# EasyEDA schematic SCH_Arduino Due (Open hardware)_2022-05-05.json

## Sheets
1 Arduino-DUE-V03 SCH
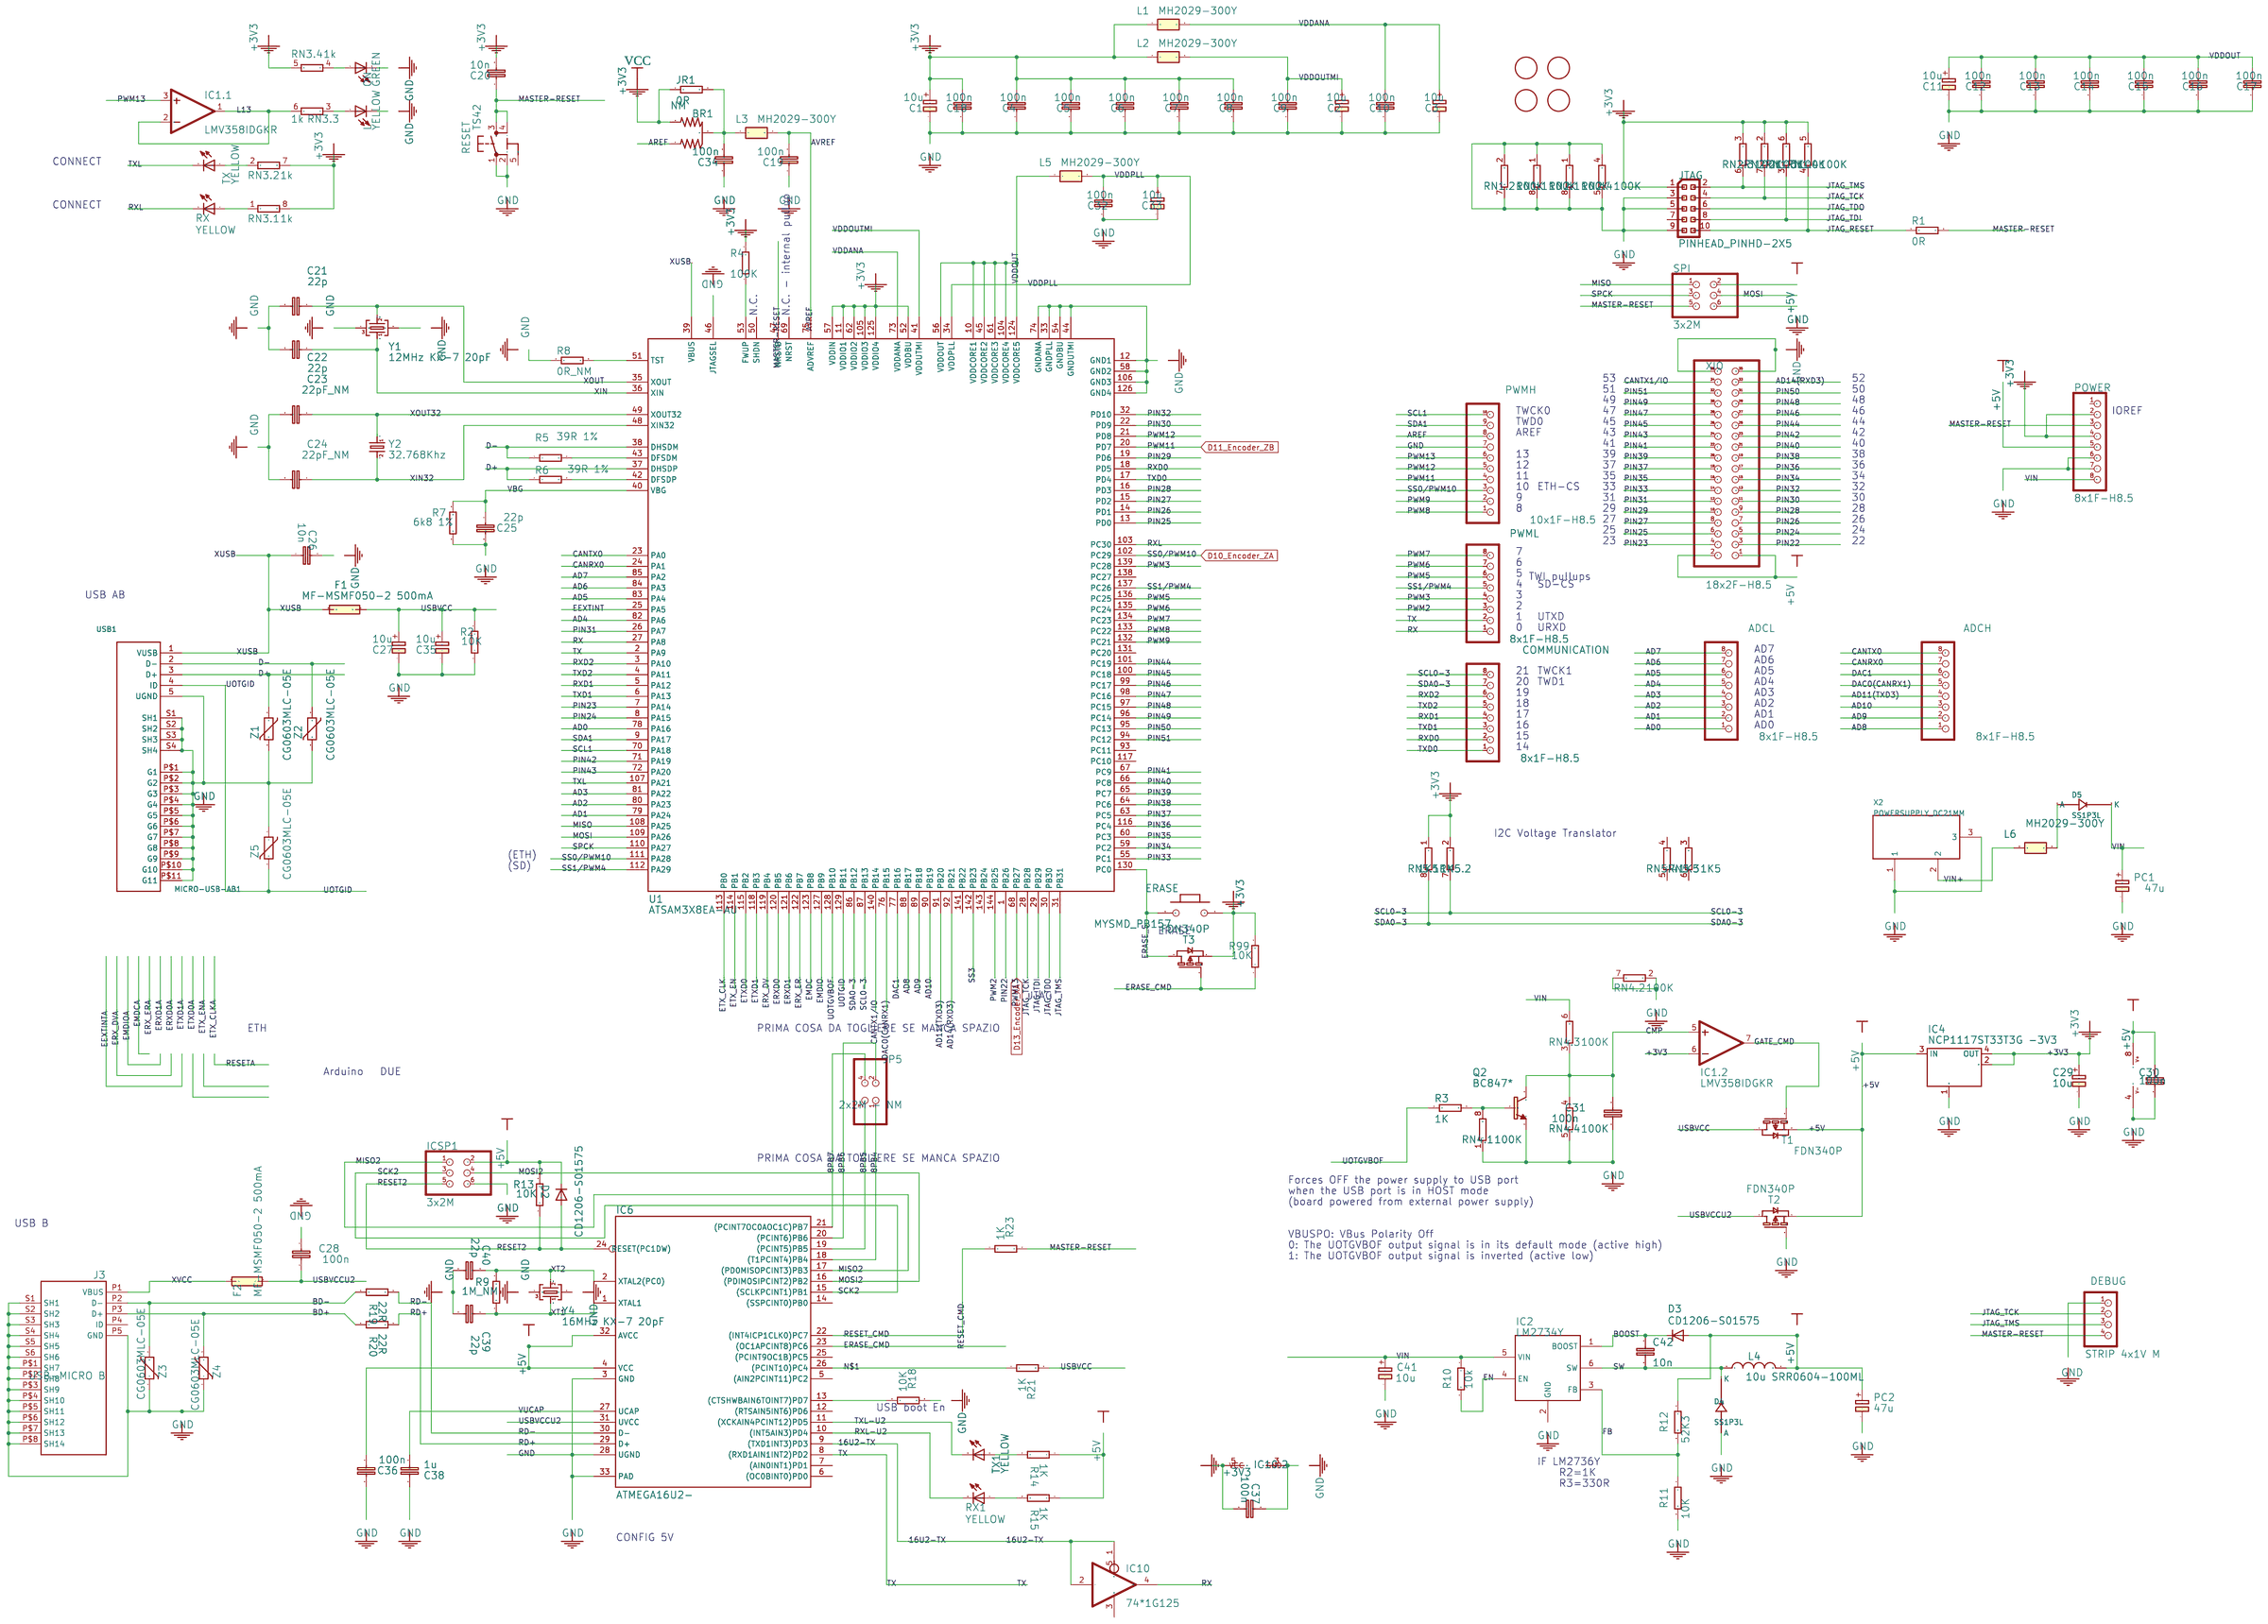
[diagram p0: Arduino-DUE-V03 SCH]
2 Pheripherie: TITLE: Periferie; REV: 1.0; Date: 2022-04-28; Sheet: 1/1; Drawn By: Radio “Radiome” Me; Company: Your Company
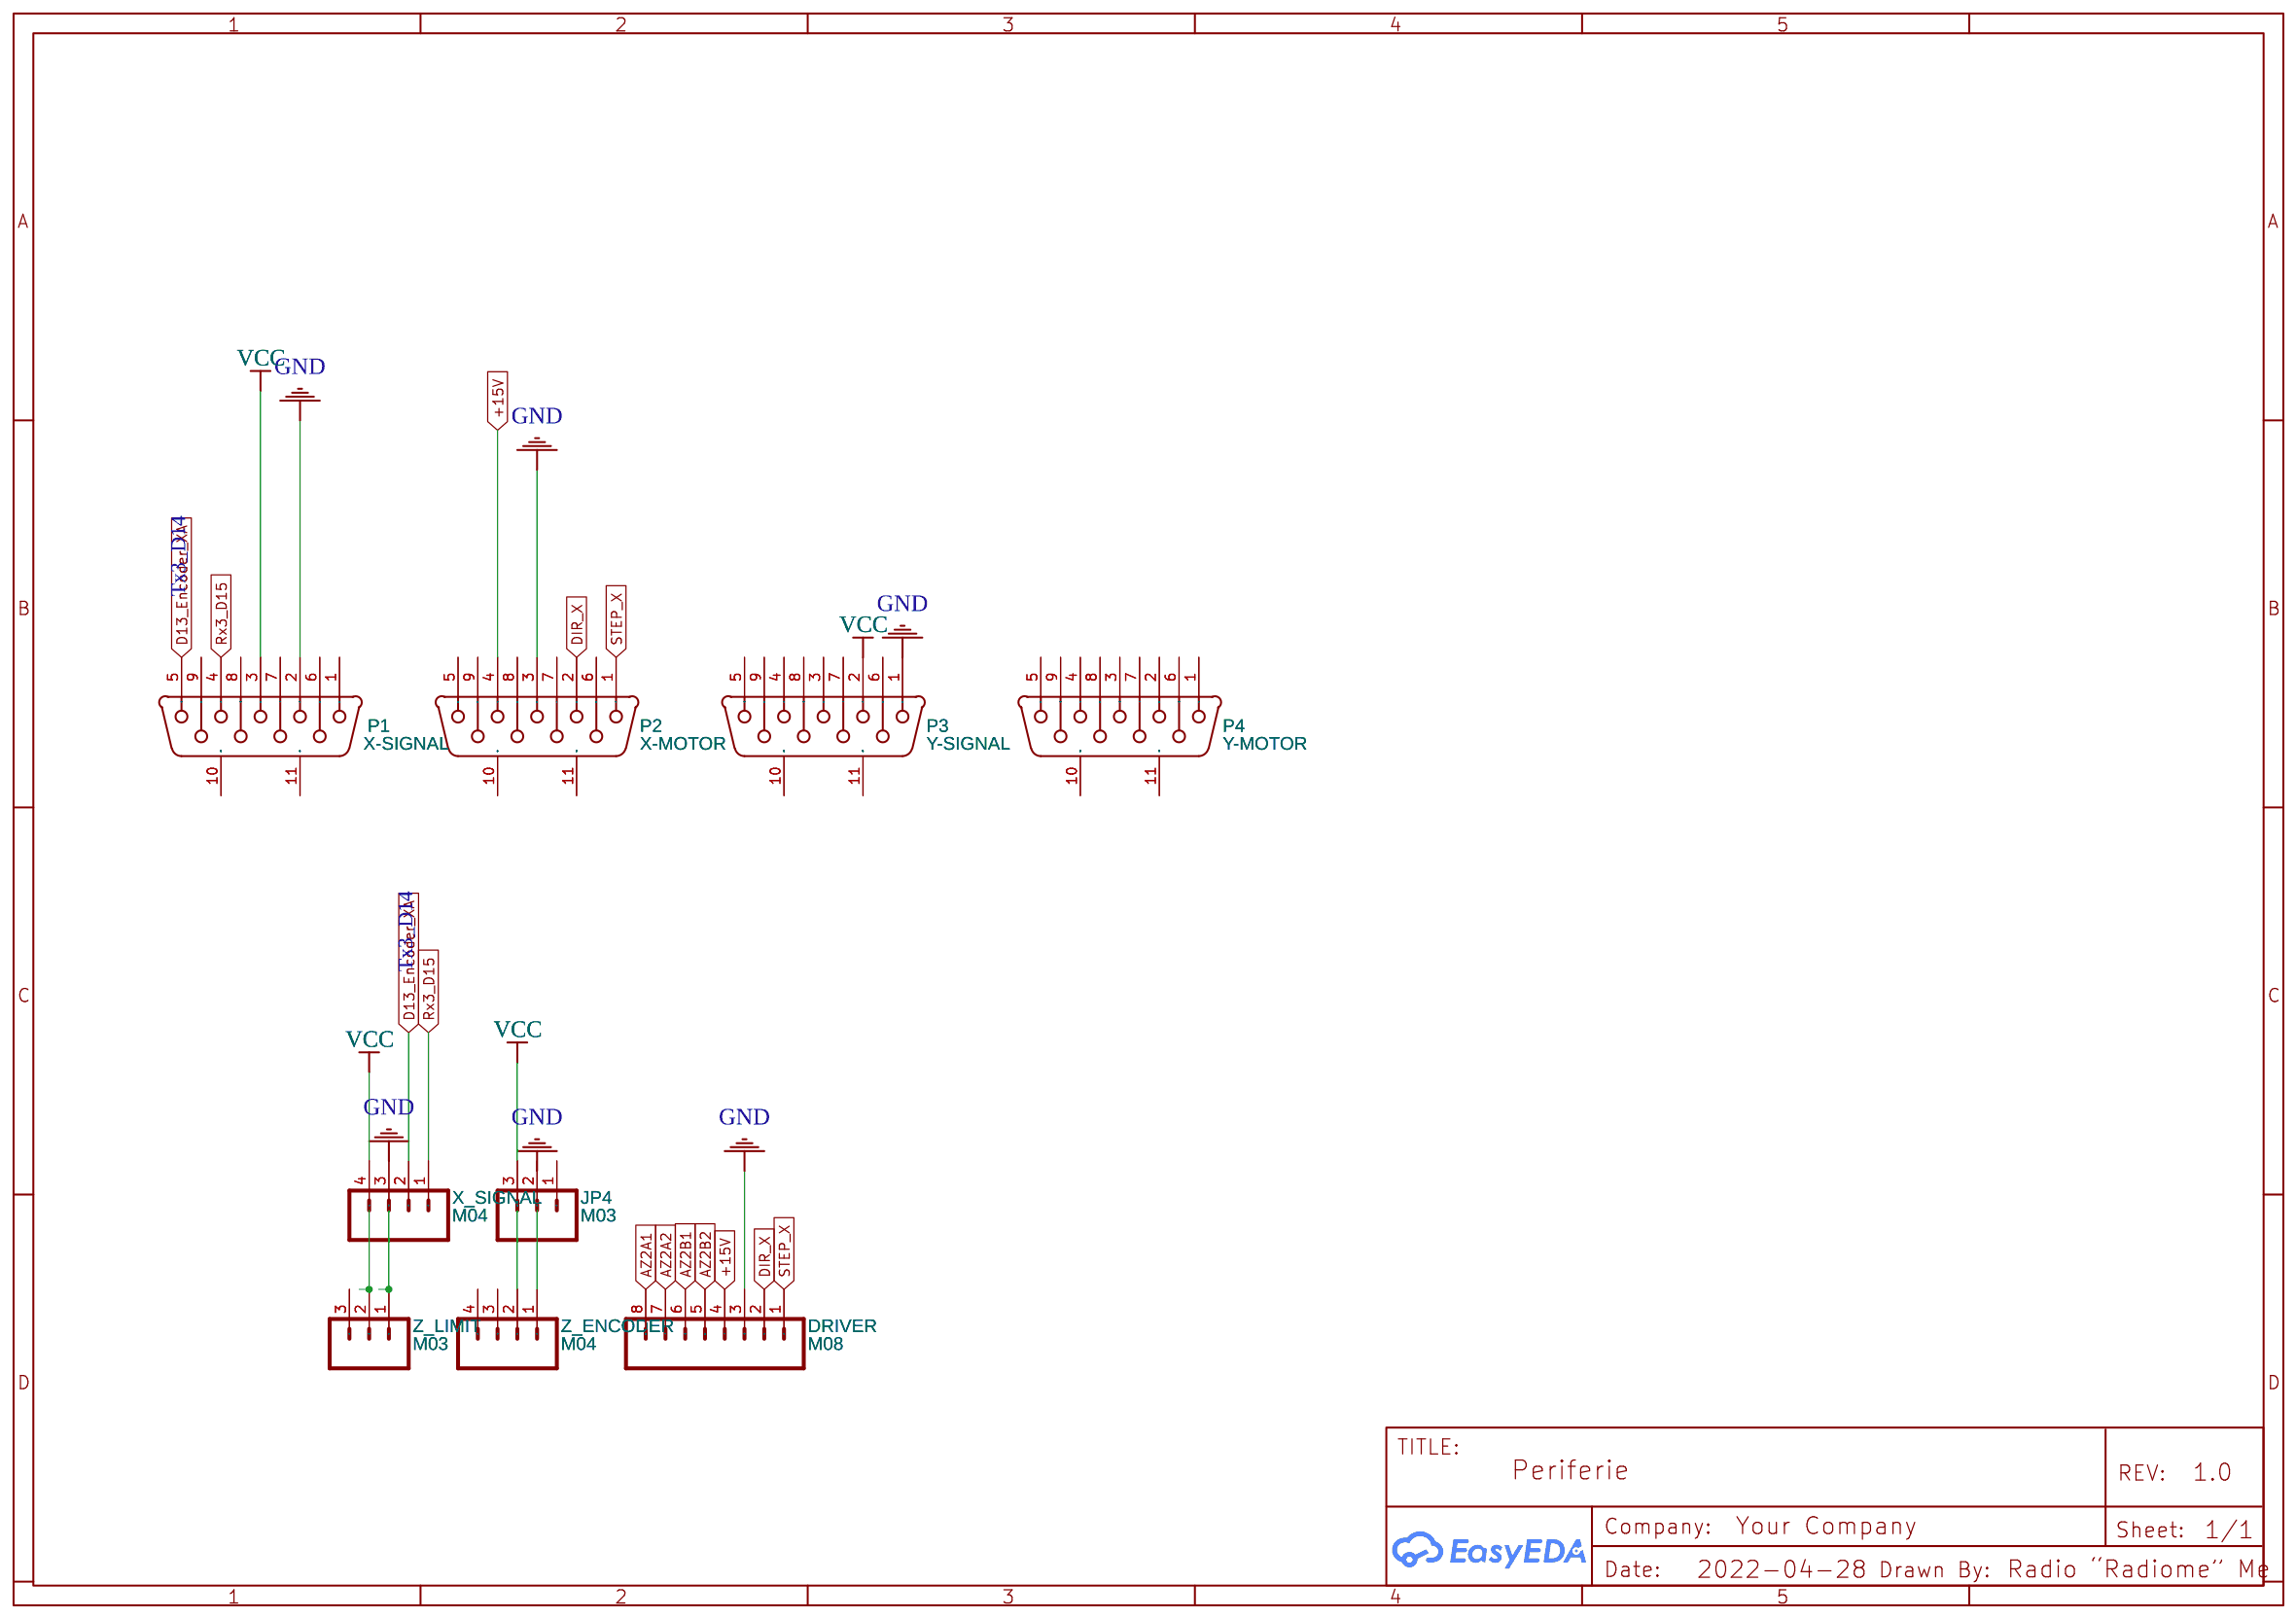
[diagram p1: Pheripherie]

## Parts
sheet Arduino-DUE-V03 SCH
ADCH  8x1F-H8.5  [1X08]
ADCL  8x1F-H8.5  [1X08]
BR1  NM  [J0402]
C1  10u  [SMC_B]
C2  10u  [SMC_B]
C3  10u  [SMC_B]
C4  100n  [C0402]
C5  100n  [C0402]
C6  100n  [C0402]
C7  100n  [C0402]
C8  100n  [C0402]
C9  100n  [C0402]
C10  100n  [C0402]
C11  10u  [SMC_B]
C12  100n  [C0402]
C13  100n  [C0402]
C14  100n  [C0402]
C15  100n  [C0402]
C16  100n  [C0402]
C17  100n  [C0402]
C18  100n  [C0402]
C19  100n  [C0402]
C20  10n  [C0402]
C21  22p  [C0402]
C22  22p  [C0402]
C23  22pF_NM  [C0402]
C24  22pF_NM  [C0402]
C25  22p  [C0402]
C26  10n  [C0402]
C27  10u  [SMC_B]
C28  100n  [C0402]
C29  10u  [SMC_B]
C30  100n  [C0402]
C31  100n  [C0402]
C32  100n  [C0402]
C33  10u  [SMC_B]
C34  100n  [C0402]
C35  10u  [SMC_B]
C36  100n  [C0402]
C37  100n  [C0402]
C38  1u  [C0402]
C39  22p  [C0402]
C40  22p  [C0402]
C41  10u  [SMC_B]
C42  10n  [C0603-ROUND]
COMMUNICATION  8x1F-H8.5  [1X08]
D2  CD1206-S01575  [MINIMELF]
D3  CD1206-S01575  [MINIMELF]
D4  SS1P3L  [DO220AAL]
D5  SS1P3L  [DO220AAL]
DEBUG  STRIP 4x1V M  [1X04]
ERASE  MYSMD_PB157  [SMD_157SW]
F1  MF-MSMF050-2 500mA  [L1812]
F2  MF-MSMF050-2 500mA  [L1812]
FID1  FIDUCIALMOUNT  [FIDUCIA-MOUNT]
FID2  FIDUCIALMOUNT  [FIDUCIA-MOUNT]
FID3  FIDUCIALMOUNT  [FIDUCIA-MOUNT]
FID4  FIDUCIALMOUNT  [FIDUCIA-MOUNT]
IC1  LMV358IDGKR  [MSOP08]  (sections 1,2,3)
IC2  LM2734Y  [SOT23-6]
IC4  NCP1117ST33T3G -3V3  [SOT223]
IC6  ATMEGA16U2-  [MLF32]
IC10  74*1G125  [SC70-5]
IC10.2  74*1G125  [SC70-5]
ICSP1  3x2M  [2X03]
J3  USB-MICRO B  [CON2_USB_MICRO_B_AT]
JP5  2x2M - NM  [2X02]
JR1  0R  [R0402]
JTAG  PINHEAD_PINHD-2X5  [PINHEAD_2X05_127]
L  YELLOW  [CHIP-LED0805]
L1  MH2029-300Y  [0805]
L2  MH2029-300Y  [0805]
L3  MH2029-300Y  [0805]
L4  10u SRR0604-100ML  [SRR0604]
L5  MH2029-300Y  [0805]
L6  MH2029-300Y  [0805]
ON  GREEN  [CHIP-LED0805]
PC1  47u  [PANASONIC_D]
PC2  47u  [PANASONIC_D]
POWER  8x1F-H8.5  [1X08]
PWMH  10x1F-H8.5  [1X10]
PWML  8x1F-H8.5  [1X08]
Q2  BC847*  [SOT23]
R1  0R  [R0402]
R2  10K  [R0402]
R3  1K  [R0402]
R4  100K  [R0402]
R5  39R 1%  [R0402]
R6  39R 1%  [R0402]
R7  6k8 1%  [R0603-ROUND]
R8  0R_NM  [R0402]
R9  1M_NM  [R0402]
R10  10k  [R0402]
R11  10K  [R0603-ROUND]
R12  52K3  [R0603-ROUND]
R13  10K  [R0402]
R14  1K  [R0402]
R15  1K  [R0402]
R18  10K  [R0402]
R19  22R  [R0402]
R20  22R  [R0402]
R21  1K  [R0402]
R23  1K  [R0402]
R99  10K  [R0402]
RESET  TS42  [TS42]
RN1  100K  [CAT16]  (sections 1,2,3,4)
RN2  100K  [CAT16]  (sections 1,2,3,4)
RN3  1k  [CAY16]  (sections 1,2,3,4)
RN4  100K  [CAT16]  (sections 1,2,3,4)
RN5  1K5  [CAT16]  (sections 1,2,3,4)
RX  YELLOW  [CHIP-LED0805]
RX1  YELLOW  [CHIP-LED0805]
SPI  3x2M  [2X03]
T1  FDN340P  [SOT-23]
T2  FDN340P  [SOT-23]
T3  FDN340P  [SOT-23]
TX  YELLOW  [CHIP-LED0805]
TX1  YELLOW  [CHIP-LED0805]
U1  ATSAM3X8EA-AU  [LQFP144]
USB1  MICRO-USB-AB1  [MCR-AB1-S-RA-SMT]
X2  POWERSUPPLY_DC21MM  [POWERSUPPLY_DC-21MM]
XIO  18x2F-H8.5  [2X18]
Y1  12MHz KX-7 20pF  [CRYSTAL-3.2-2.5]
Y2  32.768Khz  [RESONATOR_EPSON_FC_145]
Y4  16MHz KX-7 20pF  [CRYSTAL-3.2-2.5]
Z1  CG0603MLC-05E  [CTCN0603]
Z2  CG0603MLC-05E  [CTCN0603]
Z3  CG0603MLC-05E  [CTCN0603]
Z4  CG0603MLC-05E  [CTCN0603]
Z5  CG0603MLC-05E  [CTCN0603]
sheet Pheripherie
DRIVER  M08  [1X08_SMD_MALE]
JP4  M03  [1X03]
P1  X-SIGNAL  [DB9-TH_DB9-H-F_C2888345]
P2  X-MOTOR  [DB9-TH_DB9-H-F_C2888345]
P3  Y-SIGNAL  [DB9-TH_DB9-H-F_C2888345]
P4  Y-MOTOR  [DB9-TH_DB9-H-F_C2888345]
X_SIGNAL  M04  [SCREWTERMINAL-3.5MM-4]
Z_ENCODER  M04  [SCREWTERMINAL-3.5MM-4]
Z_LIMIT  M03  [1X03]

## Library data of the parts
DRIVER = M08: Contributor: SparkFun
JP4 Z_LIMIT = M03: Contributor: SparkFun
P1-P4 = DB9FL: Supplier: LCSC; Supplier Part: C9900001807; Manufacturer: null; JLCPCB Part Class: Extended Part; Contributor: LCSC
X_SIGNAL Z_ENCODER = M04: Contributor: SparkFun

## Nets
+3V3: BR1.3(2) C1.+ C4.2 C5.2 C6.2 C7.2 C8.2 C18.2 C20.2 C29.+ C37.1 ERASE.1 IC1.6(-IN) IC4.2(OUT) IC4.4(OUT) IC10.2.5(VCC) JR1.1 JTAG.1 L1.1 L2.1 POWER.2 POWER.4 R4.2 R99.2 RN1.5(2) RN1.6(2) RN2.2(1) RN2.3(1) RN3.5(2) RN3.7(2) RN3.8(2) RN5.1 RN5.2(1) T3.2(S) U1.11(VDDIO1) U1.52(VDDBU) U1.57(VDDIN) U1.62(VDDIO2) U1.105(VDDIO3) U1.125(VDDIO4)
+5V: C30.2 C36.1 D2.C D3.A IC1.8(V+) IC4.3(IN) IC6.4(VCC) IC6.32(AVCC) ICSP1.2 L4.P$2(2) PC2.+ POWER.5 R12.1 R13.2 R14.1 R15.1 SPI.2 T1.2(S) T2.2(S) XIO.1 XIO.2
+15V: DRIVER.4 P2.4
GND: C1.- C2.- C3.- C4.1 C5.1 C6.1 C7.1 C8.1 C9.1 C10.1 C11.- C12.1 C13.1 C14.1 C15.1 C16.1 C17.1 C18.1 C19.1 C21.2 C22.2 C23.2 C24.2 C25.2 C26.2 C27.- C28.2 C29.- C30.1 C31.1 C32.1 C33.- C34.1 C35.- C36.2 C37.2 C38.2 C39.2 C40.2 C41.- D4.P$2(A) DEBUG.1 DRIVER.3 IC1.4(V-) IC2.2(GND) IC4.1(GNDADJ) IC6.3(GND) IC6.28(UGND) IC6.33(PAD) IC10.2.3(GND) ICSP1.6 J3.P5(GND) J3.P$1(SH7) J3.P$2(SH8) J3.P$3(SH9) J3.P$4(SH10) J3.P$5(SH11) J3.P$6(SH12) J3.P$7(SH13) J3.P$8(SH14) J3.S1(SH1) J3.S2(SH2) J3.S3(SH3) J3.S4(SH4) J3.S5(SH5) J3.S6(SH6) JTAG.3 JTAG.5 JTAG.9 L.C ON.C P1.2 P2.3 P3.1 PC1.- PC2.- POWER.6 POWER.7 PWMH.7 Q2.2(E) R2.1 R7.1 R8.1 R11.2 R18.2 RESET.1 RESET.2 RN1.1 RN1.2(1) RN1.7(2) RN1.8(2) RN2.1 RN2.4(1) RN2.5(2) RN2.8(2) RN4.1 RN4.2(1) RN4.5(2) RN4.7(2) SPI.6 T2.3(G) U1.12(GND1) U1.33(GNDPLL) U1.44(GNDUTMI) U1.46(JTAGSEL) U1.54(GNDBU) U1.58(GND2) U1.74(GNDANA) U1.106(GND3) U1.126(GND4) USB1.5(UGND) USB1.P$1(G1) USB1.P$2(G2) USB1.P$3(G3) USB1.P$4(G4) USB1.P$5(G5) USB1.P$6(G6) USB1.P$7(G7) USB1.P$8(G8) USB1.P$9(G9) USB1.P$10(G10) USB1.P$11(G11) USB1.S1(SH1) USB1.S2(SH2) USB1.S3(SH3) USB1.S4(SH4) X2.1 X2.3 X_SIGNAL.3 XIO.35 XIO.36 Y1.2(GND) Y1.4(GND) Y4.2(GND) Y4.4(GND) Z1.2 Z2.2 Z3.1 Z4.1 Z5.1
VCC: JP4.3 P1.3 P3.2 X_SIGNAL.4
VDDANA: C3.+ C10.2 L1.2 U1.73(VDDANA)
VDDOUT: C11.+ C12.2 C13.2 C14.2 C15.2 C16.2 C17.2 L5.1 U1.10(VDDCORE1) U1.45(VDDCORE2) U1.56(VDDOUT) U1.61(VDDCORE3) U1.104(VDDCORE4) U1.124(VDDCORE5)
VDDOUTMI: C2.+ C9.2 L2.2 U1.41(VDDUTMI)
VDDPLL: C32.2 C33.+ L5.2 U1.34(VDDPLL)
VIN: C41.+ D5.P$1(K) IC2.5(VIN) PC1.+ POWER.8 R10.1 RN4.6(2)
VIN+: L6.2 X2.2
8PB4: IC6.18((T1PCINT4)PB4) JP5.1
8PB5: IC6.19((PCINT5)PB5) JP5.3
8PB6: IC6.20((PCINT6)PB6) JP5.2
8PB7: IC6.21((PCINT7OC0AOC1C)PB7) JP5.4
16U2-TX: IC6.9((TXD1INT3)PD3) IC10.1(OE) IC10.2(I)
AD0: ADCL.1 U1.78(PA16)
AD1: ADCL.2 U1.79(PA24)
AD2: ADCL.3 U1.80(PA23)
AD3: ADCL.4 U1.81(PA22)
AD4: ADCL.5 U1.82(PA6)
AD5: ADCL.6 U1.83(PA4)
AD6: ADCL.7 U1.84(PA3)
AD7: ADCL.8 U1.85(PA2)
AD8: ADCH.1 U1.88(PB17)
AD9: ADCH.2 U1.89(PB18)
AD10: ADCH.3 U1.90(PB19)
AD11(TXD3): ADCH.4 U1.91(PB20)
AD14(RXD3): U1.92(PB21) XIO.33
AREF: BR1.1 PWMH.8
AVREF: C19.2 L3.2 U1.75(ADVREF)
AZ2A1: DRIVER.8
AZ2A2: DRIVER.7
AZ2B1: DRIVER.6
AZ2B2: DRIVER.5
BD+: J3.P3(D+) R20.2 Z4.2
BD-: J3.P2(D-) R19.2 Z3.2
BOOST: C42.1 D3.C IC2.1(BOOST)
CANRX0: ADCH.7 U1.24(PA1)
CANTX0: ADCH.8 U1.23(PA0)
CANTX1/IO: U1.140(PB14) XIO.34
CMP: C31.2 IC1.5(+IN) Q2.3(C) RN4.3(1) RN4.4(1)
D10_Encoder_ZA: PWMH.3 U1.102(PC29) U1.111(PA28)
D11_Encoder_ZB: PWMH.4 U1.20(PD7)
D13_Encoder_XA: IC1.3(+IN) P1.5 PWMH.6 U1.68(PB27) X_SIGNAL.2
D+: R6.1 U1.37(DHSDP) USB1.3(D+) Z1.1
D-: R5.1 U1.38(DHSDM) USB1.2(D-) Z2.1
DAC0(CANRX1): ADCH.5 U1.76(PB15)
DAC1: ADCH.6 U1.77(PB16)
DIR_X: DRIVER.2 P2.2
EEXTINT: U1.25(PA5)
EMDC: U1.123(PB8)
EMDIO: U1.127(PB9)
EN: IC2.4(EN) R10.2
ERASE_CMD: IC6.23((OC1APCINT8)PC6) R99.1 T3.3(G)
ERASE_S: ERASE.2 T3.1(D) U1.130(PC0)
ERX_DV: U1.119(PB4)
ERX_ER: U1.122(PB7)
ERXD0: U1.120(PB5)
ERXD1: U1.121(PB6)
ETX_CLK: U1.113(PB0)
ETX_EN: U1.114(PB1)
ETXD0: U1.115(PB2)
ETXD1: U1.118(PB3)
FB: IC2.3(FB) R11.1 R12.2
GATE_CMD: IC1.7(OUT) T1.3(G)
JTAG_RESET: JTAG.10 R1.1 RN1.4(1)
JTAG_TCK: DEBUG.2 JTAG.4 RN2.7(2) U1.28(PB28)
JTAG_TDI: JTAG.8 RN1.3(1) U1.29(PB29)
JTAG_TDO: JTAG.6 U1.30(PB30)
JTAG_TMS: DEBUG.3 JTAG.2 RN2.6(2) U1.31(PB31)
L13: IC1.1(OUT) IC1.2(-IN) RN3.6(2)
MASTER-RESET: C20.1 DEBUG.4 POWER.3 R1.2 R23.2 RESET.3 RESET.4 SPI.5 U1.47(NRSTB)
MISO: SPI.1 U1.108(PA25)
MISO2: IC6.17((PD0MISOPCINT3)PB3) ICSP1.1
MOSI: SPI.4 U1.109(PA26)
MOSI2: IC6.16((PDIMOSIPCINT2)PB2) ICSP1.4
N$1: IC6.26((PCINT10)PC4) R21.1
PIN22: U1.1(PB26) XIO.3
PIN23: U1.7(PA14) XIO.4
PIN24: U1.8(PA15) XIO.5
PIN25: U1.13(PD0) XIO.6
PIN26: U1.14(PD1) XIO.7
PIN27: U1.15(PD2) XIO.8
PIN28: U1.16(PD3) XIO.9
PIN29: U1.19(PD6) XIO.10
PIN30: U1.22(PD9) XIO.11
PIN31: U1.26(PA7) XIO.12
PIN32: U1.32(PD10) XIO.13
PIN33: U1.55(PC1) XIO.14
PIN34: U1.59(PC2) XIO.15
PIN35: U1.60(PC3) XIO.16
PIN36: U1.116(PC4) XIO.17
PIN37: U1.63(PC5) XIO.18
PIN38: U1.64(PC6) XIO.19
PIN39: U1.65(PC7) XIO.20
PIN40: U1.66(PC8) XIO.21
PIN41: U1.67(PC9) XIO.22
PIN42: U1.71(PA19) XIO.23
PIN43: U1.72(PA20) XIO.24
PIN44: U1.101(PC19) XIO.25
PIN45: U1.100(PC18) XIO.26
PIN46: U1.99(PC17) XIO.27
PIN47: U1.98(PC16) XIO.28
PIN48: U1.97(PC15) XIO.29
PIN49: U1.96(PC14) XIO.30
PIN50: U1.95(PC13) XIO.31
PIN51: U1.94(PC12) XIO.32
PWM2: PWML.3 U1.144(PB25)
PWM3: PWML.4 U1.139(PC28)
PWM5: PWML.6 U1.136(PC25)
PWM6: PWML.7 U1.135(PC24)
PWM7: PWML.8 U1.134(PC23)
PWM8: PWMH.1 U1.133(PC22)
PWM9: PWMH.2 U1.132(PC21)
PWM12: PWMH.5 U1.21(PD8)
RD+: IC6.29(D+) R20.1
RD-: IC6.30(D-) R19.1
RESET2: D2.A IC6.24(RESET(PC1DW)) ICSP1.5 R13.1
RESET_CMD: IC6.22((INT4ICP1CLK0)PC7) R23.1
RX: IC10.4(O) PWML.1 U1.27(PA8)
Rx3_D15: P1.4 X_SIGNAL.1
RXD0: COMMUNICATION.2 U1.18(PD5)
RXD1: COMMUNICATION.4 U1.5(PA12)
RXD2: COMMUNICATION.6 U1.3(PA10)
RXL: RX.C U1.103(PC30)
RXL-U2: IC6.10((INT5AIN3)PD4) RX1.C
SCK2: IC6.15((SCLKPCINT1)PB1) ICSP1.3
SCL0-3: COMMUNICATION.8 RN5.7(2) U1.87(PB13)
SCL1: PWMH.10 U1.70(PA18)
SDA0-3: COMMUNICATION.7 RN5.8(2) U1.86(PB12)
SDA1: PWMH.9 U1.9(PA17)
SPCK: SPI.3 U1.110(PA27)
SS1/PWM4: PWML.5 U1.112(PA29) U1.137(PC26)
SS3: U1.142(PB23)
STEP_X: DRIVER.1 P2.1
SW: C42.2 D4.P$1(K) IC2.6(SW) L4.P$1(1)
TX: IC6.8((RXD1AIN1INT2)PD2) PWML.2 U1.2(PA9)
TXD0: COMMUNICATION.1 U1.17(PD4)
TXD1: COMMUNICATION.3 U1.6(PA13)
TXD2: COMMUNICATION.5 U1.4(PA11)
TXL: TX.C U1.107(PA21)
TXL-U2: IC6.11((XCKAIN4PCINT12)PD5) TX1.C
UOTGID: U1.129(PB11) USB1.4(ID) Z5.2
UOTGVBOF: R3.1 U1.128(PB10)
USBVCC: C27.+ C35.+ F1.1 R2.2 R21.2 T1.1(D)
USBVCCU2: C28.1 F2.1 IC6.31(UVCC) T2.1(D)
VBG: C25.1 R7.2 U1.40(VBG)
VUCAP: C38.1 IC6.27(UCAP)
XIN: C22.1 U1.36(XIN) Y1.1(C1)
XIN32: C24.1 U1.48(XIN32) Y2.P$2(2)
XOUT: C21.1 U1.35(XOUT) Y1.3(C2)
XOUT32: C23.1 U1.49(XOUT32) Y2.P$1(1)
XT1: C39.1 IC6.1(XTAL1) R9.1 Y4.1(C1)
XT2: C40.1 IC6.2(XTAL2(PC0)) R9.2 Y4.3(C2)
XUSB: C26.1 F1.2 U1.39(VBUS) USB1.1(VUSB)
XVCC: F2.2 J3.P1(VBUS)
Net-(BR1-2): BR1.2(C) C34.2 JR1.2 L3.1
Net-(D5-P$2): D5.P$2(A) L6.1
Net-(IC6-13): IC6.13((CTSHWBAIN6TOINT7)PD7) R18.1
Net-(L-A): L.A RN3.3(1)
Net-(ON-A): ON.A RN3.4(1)
Net-(Q2-1): Q2.1(B) R3.2 RN4.8(2)
Net-(R4-1): R4.1 U1.53(FWUP)
Net-(R5-2): R5.2 U1.43(DFSDM)
Net-(R6-2): R6.2 U1.42(DFSDP)
Net-(R8-2): R8.2 U1.51(TST)
Net-(R14-2): R14.2 TX1.A
Net-(R15-2): R15.2 RX1.A
Net-(RN3.1-1): RN3.1 RX.A
Net-(RN3.2-2): RN3.2(1) TX.A

Not connected (* = marked no-connect by the designer): IC6 5((AIN2PCINT11)PC2) 6((OC0BINT0)PD0) 7((AIN0INT1)PD1) 12((RTSAIN5INT6)PD6) 14((SSPCINT0)PB0) 25((PCINT9OC1B)PC5); IC10 3(GND) 5(VCC); J3 P4(ID); JP4 1 2; JTAG 7; P1 1 6 7 8 9 10(MH1) 11(MH2); P2 5 6 7 8 9 10(MH1) 11(MH2); P3 3 4 5 6 7 8 9 10(MH1) 11(MH2); P4 1 2 3 4 5 6 7 8 9 10(MH1) 11(MH2); POWER 1; RESET 5(5-GND); RN5 3(1) 4(1) 5(2) 6(2); U1 50(SHDN) 69(NRST) 93(PC11) 117(PC10) 131(PC20) 138(PC27) 141(PB22) 143(PB24); Z_ENCODER 1 2 3 4; Z_LIMIT 1 2 3

## Notes on the sheets
sheet 1
- CONNECT
- CONNECT
- N.C.
- N.C. - internal pullup
- 53
- 52
- 49
- 51
- 48
- 50
- TWCK0
- 47
- 46
- IOREF
- TWD0
- 45
- 44
- AREF
- 43
- 42
- 41
- 40
- 13
- 39
- 38
- 11
- 12
- 35
- 37
- 34
- 36
- 10
- ETH-CS
- 33
- 32
- 9
- 31
- 30
- 8
- 29
- 28
- 27
- 26
- 25
- 24
- 7
- 23
- 22
- 6
- 5
- TWI pullups
- 4
- SD-CS
- USB AB
- 3
- 1
- 2
- UTXD
- 0
- URXD
- AD7
- AD6
- 21
- TWCK1
- AD5
- 19
- 20
- TWD1
- AD3
- AD4
- 18
- AD2
- 17
- AD1
- 16
- AD0
- 15
- 14
- I2C Voltage Translator
- (ETH)
- (SD)
- ERASE
- JTAG
- ETH
- PRIMA COSA DA TOGLIERE SE MANCA SPAZIO
- Arduino   DUE
- PRIMA COSA DA TOGLIERE SE MANCA SPAZIO
- Forces OFF the power supply to USB port
- when the USB port is in HOST mode
- (board powered from external power supply)
- USB B
- VBUSPO: VBus Polarity Off
- 0: The UOTGVBOF output signal is in its default mode (active high)
- 1: The UOTGVBOF output signal is inverted (active low)
- USB boot En
- IF LM2736Y
- R2=1K
- R3=330R
- CONFIG 5V
- Reference Designs ARE PROVIDED AS IS AND WITH ALL FAULTS. Arduino DISCLAIMS ALL OTHER WARRANTIES, EXPRESS OR IMPLIED,REGARDING PRODUCTS, INCLUDINF BUT NOT LIMITED TO, ANY IMPLIED WARRIENTIS OR MERCHANTABILITY OR FITNESS FOR A PARTICULAR PURPOSEArduino may make changes to specifications and product descriptions at any tie, without notice. The customer must not rely on the absence of characteristics of any features or instructions marked reserved or undefined. Arduino reservesthese for future definition and shall have no responsibility whatsover for conflicts or incompatibilities arising from future changes to them.The product information on the Web Site or Materials is subject to change without notice. Do nor finalize a design with this information.The ARDUINO logo is a trademark of Arduino LLC registered in the US and in the rest of the world.Use of the Arduino name must be compliant with http:www.arduino.ccenMainPolicy
sheet 2
- Tx3_D14
- Tx3_D14
